# Altium project digital kitchen scale.PrjPcb
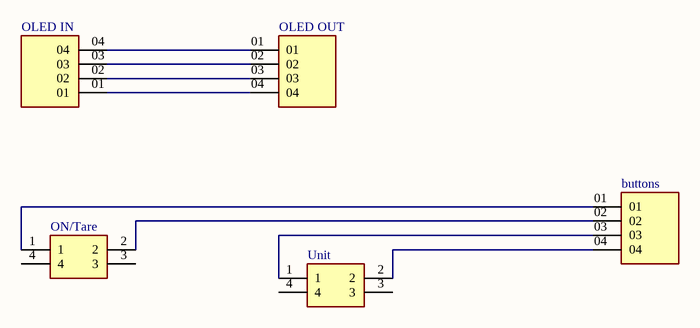
[diagram p0: second_pcb.SchDoc]
1 sheet, 5 parts. Net scope: global (net labels, ports and power ports of the same name join across sheets).
Board files: [1] initial circuit.PcbDoc, pcb.PcbDoc, second_pcb.PcbDoc

## Sheet second_pcb.SchDoc
size A; SheetNumber: 2; SheetTotal: 2

### Parts
buttons  MTSW-104-XX-X-S-XXX  [SAMTEC_MTSW-104-XX-X-S-XXX]  (value not drawn)
OLED_IN  MTSW-104-XX-X-S-XXX  [SAMTEC_MTSW-104-XX-X-S-XXX]  (value not drawn)
OLED_OUT  MTSW-104-XX-X-S-XXX  [SAMTEC_MTSW-104-XX-X-S-XXX]  (value not drawn)
ON/Tare  FSM12JH  [FSM12JH]  (value not drawn)
Unit  FSM12JH  [FSM12JH]  (value not drawn)

### Nets
Netbuttons_01: buttons.01 ON/Tare.1
Netbuttons_02: buttons.02 ON/Tare.2
Netbuttons_03: buttons.03 Unit.1
Netbuttons_04: buttons.04 Unit.2
NetOLED_IN_01: OLED_IN.01 OLED_OUT.04
NetOLED_IN_02: OLED_IN.02 OLED_OUT.03
NetOLED_IN_03: OLED_IN.03 OLED_OUT.02
NetOLED_IN_04: OLED_IN.04 OLED_OUT.01

Not connected (* = marked no-connect by the designer): ON/Tare 3 4; Unit 3 4

### Library data of the parts
buttons OLED_IN OLED_OUT = MTSW-104-XX-X-S-XXX: MF: Samtec; MP: MTSW-104-12-F-S-850; SnapEDA_Link: https://www.snapeda.com/parts/MTSW-104-12-F-S-850/Samtec/view-part/6593359/?ref=snap; Value: *; Check_prices: https://www.snapeda.com/parts/MTSW-104-12-F-S-850/Samtec/view-part/6593359/?ref=eda; Price: None; Availability: No availability data; Package: None
ON/Tare Unit = FSM12JH: TE CONNECTIVITY / ALCOSWITCH - FSM12JH - FSM12JH=6MM TACT SWITCH, HIGH TEMP 23R8443; Geometry.Height: 8mm; Mouser Part Number: 506-FSM12JH; Mouser Price/Stock: https://www.mouser.co.uk/ProductDetail/TE-Connectivity/FSM12JH?qs=qzQkFgQjdxUp2583VNq5KQ%3D%3D; Manufacturer_Name: TE Connectivity; Manufacturer_Part_Number: FSM12JH; Datasheet Link: https://www.te.com/commerce/DocumentDelivery/DDEController?Action=srchrtrv&DocNm=1825910&DocType=Customer+Drawing&DocLang=English&DocFormat=pdf&PartCntxt=2-1825910-2